# Altium schematic sheet MCU.SchDoc: Flyer_MCU
size A4
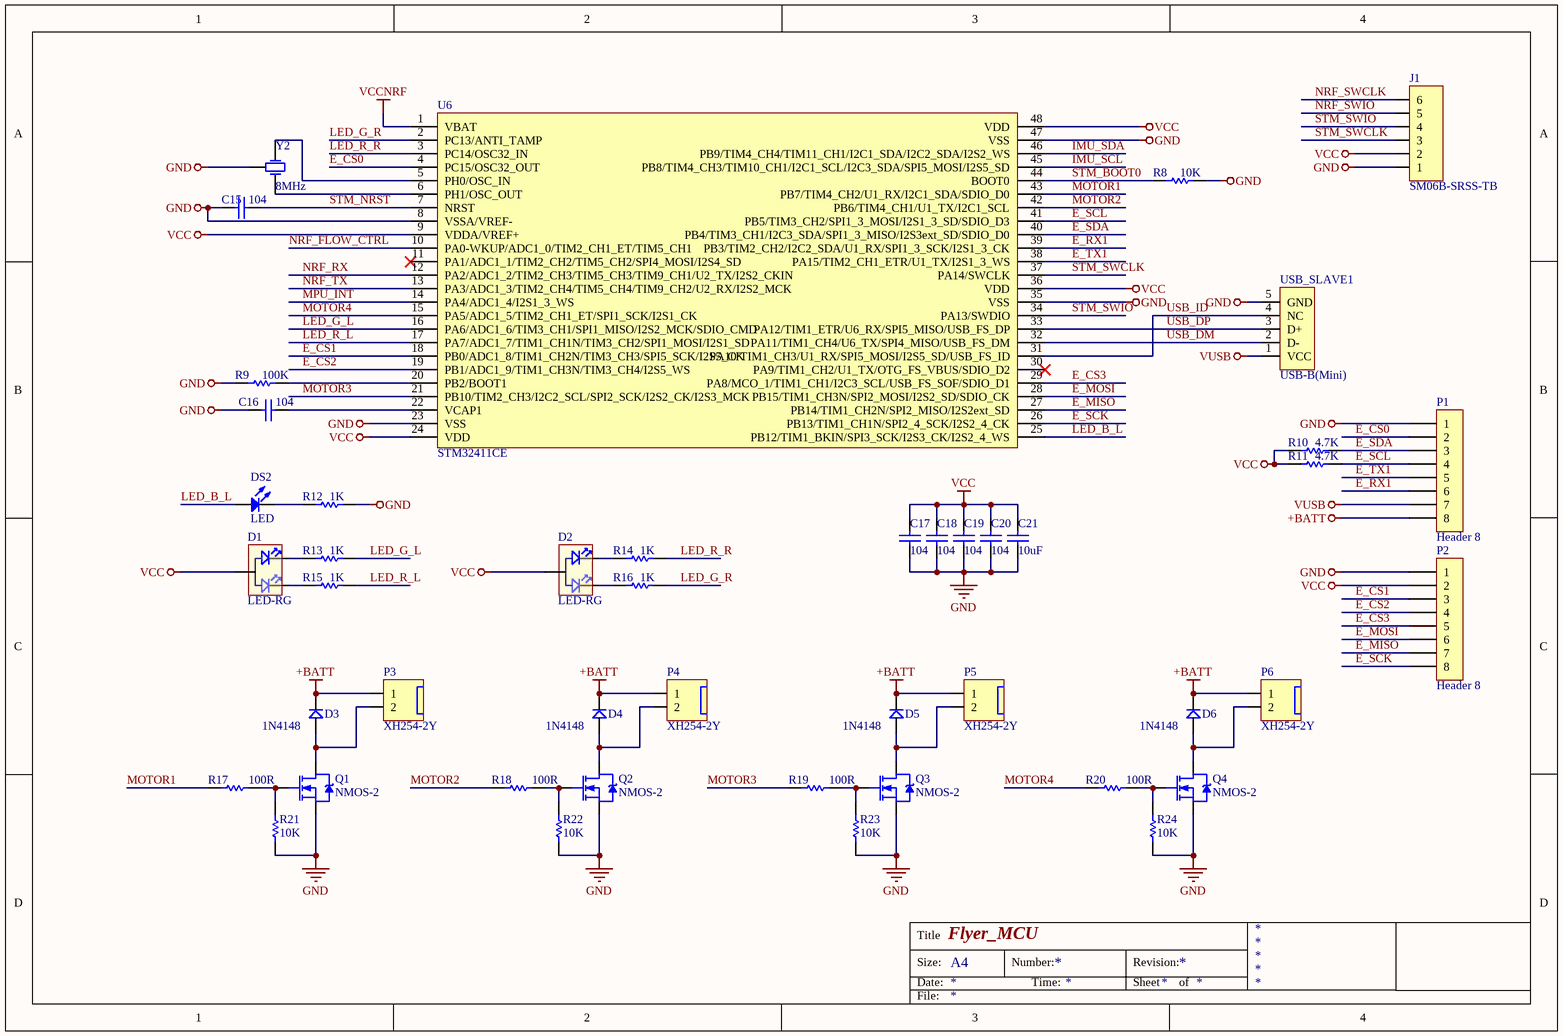
[diagram p0: MCU.SchDoc]

## Parts
C15  104  [C0603]
C16  104  [C0603]
C17  104  [C0603]
C18  104  [C0603]
C19  104  [C0603]
C20  104  [C0603]
C21  10uF  [C0603]
D1  LED-RG  [LED-2-1206]
D2  LED-RG  [LED-2-1206]
D3  1N4148  [SOD-523]
D4  1N4148  [SOD-523]
D5  1N4148  [SOD-523]
D6  1N4148  [SOD-523]
DS2  LED  [LED-2-1206]
J1  SM06B-SRSS-TB  [SM06B-SRSS-TB]
P1  Header 8  [HDR1X8]
P2  Header 8  [HDR1X8]
P3  XH254-2Y  [XH-AW-125-2Y]
P4  XH254-2Y  [XH-AW-125-2Y]
P5  XH254-2Y  [XH-AW-125-2Y]
P6  XH254-2Y  [XH-AW-125-2Y]
Q1  NMOS-2  [SOT-23-3L]
Q2  NMOS-2  [SOT-23-3L]
Q3  NMOS-2  [SOT-23-3L]
Q4  NMOS-2  [SOT-23-3L]
R8  10K  [R0603]
R9  100K  [R0603]
R10  4.7K  [R0603]
R11  4.7K  [R0603]
R12  1K  [R0603]
R13  1K  [R0603]
R14  1K  [R0603]
R15  1K  [R0603]
R16  1K  [R0603]
R17  100R  [R0603]
R18  100R  [R0603]
R19  100R  [R0603]
R20  100R  [R0603]
R21  10K  [R0603]
R22  10K  [R0603]
R23  10K  [R0603]
R24  10K  [R0603]
U6  STM32411CE  [UFQFPN48]
USB_SLAVE1  USB-B(Mini)  [USB-MicroUSB]
Y2  8MHz  [X-CSTCE]

## Nets
+BATT: D3.2 D4.2 D5.2 D6.2 P1.8 P3.1 P4.1 P5.1 P6.1
GND: C15.2 C16.2 C17.1 C18.1 C19.1 C20.1 C21.1 J1.1 P1.1 P2.1 Q1.3(S) Q2.3(S) Q3.3(S) Q4.3(S) R8.1 R9.2 R12.1 R21.1 R22.1 R23.1 R24.1 U6.8(VSSA/VREF-) U6.23(VSS) U6.35(VSS) U6.47(VSS) USB_SLAVE1.5(GND) Y2.3
VCC: C17.2 C18.2 C19.2 C20.2 C21.2 D1.1 D2.1 J1.2 P2.2 R10.2 R11.2 U6.9(VDDA/VREF+) U6.24(VDD) U6.36(VDD) U6.48(VDD)
VCCNRF: U6.1(VBAT)
VUSB: P1.7 USB_SLAVE1.1(VCC)
E_CS0: P1.2 U6.4(PC15/OSC32_OUT)
E_CS1: P2.3 U6.18(PB0/ADC1_8/TIM1_CH2N/TIM3_CH3/SPI5_SCK/I2S5_CK)
E_CS2: P2.4 U6.19(PB1/ADC1_9/TIM1_CH3N/TIM3_CH4/I2S5_WS)
E_CS3: P2.5 U6.29(PA8/MCO_1/TIM1_CH1/I2C3_SCL/USB_FS_SOF/SDIO_D1)
E_MISO: P2.7 U6.27(PB14/TIM1_CH2N/SPI2_MISO/I2S2ext_SD)
E_MOSI: P2.6 U6.28(PB15/TIM1_CH3N/SPI2_MOSI/I2S2_SD/SDIO_CK)
E_RX1: P1.6 U6.39(PB3/TIM2_CH2/I2C2_SDA/U1_RX/SPI1_3_SCK/I2S1_3_CK)
E_SCK: P2.8 U6.26(PB13/TIM1_CH1N/SPI2_4_SCK/I2S2_4_CK)
E_SCL: P1.4 R11.1 U6.41(PB5/TIM3_CH2/SPI1_3_MOSI/I2S1_3_SD/SDIO_D3)
E_SDA: P1.3 R10.1 U6.40(PB4/TIM3_CH1/I2C3_SDA/SPI1_3_MISO/I2S3ext_SD/SDIO_D0)
E_TX1: P1.5 U6.38(PA15/TIM2_CH1_ETR/U1_TX/I2S1_3_WS)
IMU_SCL: U6.45(PB8/TIM4_CH3/TIM10_CH1/I2C1_SCL/I2C3_SDA/SPI5_MOSI/I2S5_SD)
IMU_SDA: U6.46(PB9/TIM4_CH4/TIM11_CH1/I2C1_SDA/I2C2_SDA/I2S2_WS)
LED_B_L: DS2.1(A) U6.25(PB12/TIM1_BKIN/SPI3_SCK/I2S3_CK/I2S2_4_WS)
LED_G_L: R13.1 U6.16(PA6/ADC1_6/TIM3_CH1/SPI1_MISO/I2S2_MCK/SDIO_CMD)
LED_G_R: R16.1 U6.2(PC13/ANTI_TAMP)
LED_R_L: R15.1 U6.17(PA7/ADC1_7/TIM1_CH1N/TIM3_CH2/SPI1_MOSI/I2S1_SD)
LED_R_R: R14.1 U6.3(PC14/OSC32_IN)
MOTOR1: R17.1 U6.43(PB7/TIM4_CH2/U1_RX/I2C1_SDA/SDIO_D0)
MOTOR2: R18.1 U6.42(PB6/TIM4_CH1/U1_TX/I2C1_SCL)
MOTOR3: R19.1 U6.21(PB10/TIM2_CH3/I2C2_SCL/SPI2_SCK/I2S2_CK/I2S3_MCK)
MOTOR4: R20.1 U6.15(PA5/ADC1_5/TIM2_CH1_ET/SPI1_SCK/I2S1_CK)
MPU_INT: U6.14(PA4/ADC1_4/I2S1_3_WS)
NRF_FLOW_CTRL: U6.10(PA0-WKUP/ADC1_0/TIM2_CH1_ET/TIM5_CH1)
NRF_RX: U6.12(PA2/ADC1_2/TIM2_CH3/TIM5_CH3/TIM9_CH1/U2_TX/I2S2_CKIN)
NRF_SWCLK: J1.6
NRF_SWIO: J1.5
NRF_TX: U6.13(PA3/ADC1_3/TIM2_CH4/TIM5_CH4/TIM9_CH2/U2_RX/I2S2_MCK)
STM_BOOT0: R8.2 U6.44(BOOT0)
STM_NRST: C15.1 U6.7(NRST)
STM_SWCLK: J1.3 U6.37(PA14/SWCLK)
STM_SWIO: J1.4 U6.34(PA13/SWDIO)
USB_DM: U6.32(PA11/TIM1_CH4/U6_TX/SPI4_MISO/USB_FS_DM) USB_SLAVE1.2(D-)
USB_DP: U6.33(PA12/TIM1_ETR/U6_RX/SPI5_MISO/USB_FS_DP) USB_SLAVE1.3(D+)
USB_ID: U6.31(PA10/TIM1_CH3/U1_RX/SPI5_MOSI/I2S5_SD/USB_FS_ID) USB_SLAVE1.4(NC)
NetC16_1: C16.1 U6.22(VCAP1)
NetD1_2: D1.2 R15.2
NetD1_3: D1.3 R13.2
NetD2_2: D2.2 R16.2
NetD2_3: D2.3 R14.2
NetD3_1: D3.1 P3.2 Q1.2(D)
NetD4_1: D4.1 P4.2 Q2.2(D)
NetD5_1: D5.1 P5.2 Q3.2(D)
NetD6_1: D6.1 P6.2 Q4.2(D)
NetDS2_2: DS2.2(K) R12.2
NetQ1_1: Q1.1(G) R17.2 R21.2
NetQ2_1: Q2.1(G) R18.2 R22.2
NetQ3_1: Q3.1(G) R19.2 R23.2
NetQ4_1: Q4.1(G) R20.2 R24.2
NetR9_1: R9.1 U6.20(PB2/BOOT1)
NetU6_5: U6.5(PH0/OSC_IN) Y2.1(OSC1)
NetU6_6: U6.6(PH1/OSC_OUT) Y2.2(OSC2)

Not connected (* = marked no-connect by the designer): U6 11(PA1/ADC1_1/TIM2_CH2/TIM5_CH2/SPI4_MOSI/I2S4_SD)* 30(PA9/TIM1_CH2/U1_TX/OTG_FS_VBUS/SDIO_D2)*

## Notes on the sheet
- Title
- Size:
- Date:
- A4
- Number:
- Time:
- Revision:
- Sheet
- of
- File:

## Library data of the parts
C15-C21 = C0603: 电容; Published: 8-Jun-2000; LatestRevisionDate: 17-Jul-2002; LatestRevisionNote: Re-released for DXP Platform.; PackageReference: RAD-0.3; Publisher: Altium Limited; PackageDescription: Radial Cap, Thru-Hole; 2 Leads; 0.3 in Pin Spacing; UnitPrice: 0.02
D1 D2 = LED-2: LED 1206 侧贴 双色
D3-D6 = D: 通用二极管
DS2 = LED: Typical RED, GREEN, YELLOW, AMBER GaAs LED; Published: 8-Jun-2000; LatestRevisionDate: 17-Jul-2002; LatestRevisionNote: Re-released for DXP Platform.; PackageDocument: Feb-2002; PackageReference: 3.2X1.6X1.1; Publisher: Altium Limited; UnitPrice: 0.05
P1 P2 = Header 8: Header, 8-Pin; LatestRevisionDate: 17-Jul-2002; LatestRevisionNote: Re-released for DXP Platform.; Publisher: Altium Limited
Q1-Q4 = NMOS-2: N-Channel Power MOSFET; Note: Pin 2 is electrically connected to pin 4.; Published: 8-Jun-2000; LatestRevisionDate: 17-Jul-2002; LatestRevisionNote: Re-released for DXP Platform.; DatasheetVersion: PD-9.814; PackageVersion: Feb-1997; PackageReference: TO-220AB; Publisher: Altium Limited; PackageDescription: TO, Thru-Hole, Vertical, Heatsink Mounted; 3 In-Line Leads; Pitch 2.54 mm; ComponentLink1Description: Manufacturer Link; ComponentLink1URL: http://www.irf.com/
R8-R24 = RES0603: 电阻; Published: 8-Jun-2000; LatestRevisionDate: 17-Jul-2002; LatestRevisionNote: Re-released for DXP Platform.; PackageReference: AXIAL-0.3; Publisher: Altium Limited; PackageDescription: Axial Device, Thru-Hole; 2 Leads; 0.3 in Pin Spacing
U6 = STM32F411xC: STM32411xC_xE
USB_SLAVE1 = USB5
Y2 = XTAL_2: Crystal Oscillator; Published: 8-Jun-2000; LatestRevisionDate: 17-Jul-2002; LatestRevisionNote: Re-released for DXP Platform.; Publisher: Altium Limited
P3-P6 = XH254-2Y: LatestRevisionDate: 17-Jul-2002; LatestRevisionNote: Re-released for DXP Platform.; Publisher: Altium Limited